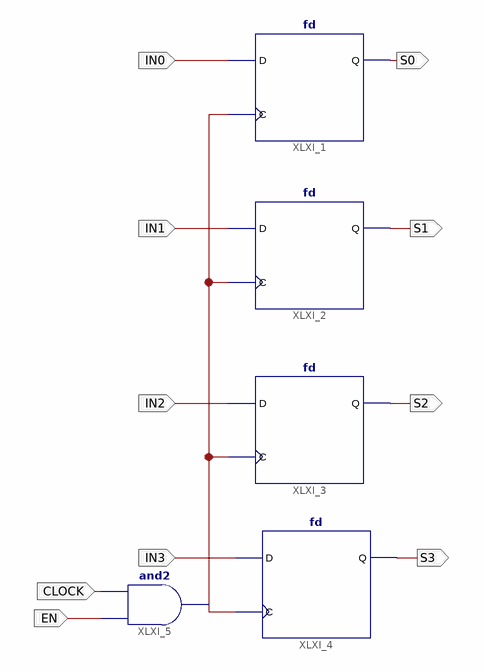
[diagram p0: schematic sheet 1]
// Xilinx ISE schematic Register_4_bit.sch (spartan3e) as structural Verilog: 5 symbols, 10 ports
module Register_4_bit (
  input  IN0,
  input  IN1,
  input  IN2,
  input  IN3,
  input  CLOCK,
  input  EN,
  output S0,
  output S1,
  output S2,
  output S3
);

  wire CLK;

  fd XLXI_1 (.C(CLK), .D(IN0), .Q(S0));
  fd XLXI_2 (.C(CLK), .D(IN1), .Q(S1));
  fd XLXI_3 (.C(CLK), .D(IN2), .Q(S2));
  fd XLXI_4 (.C(CLK), .D(IN3), .Q(S3));
  and XLXI_5 (CLK, EN, CLOCK);
endmodule
